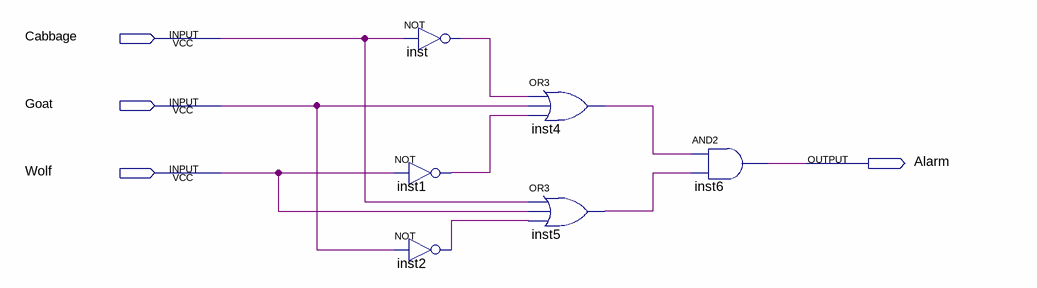
[diagram p0: schematic sheet]
// Quartus schematic lab3step0.bdf as structural Verilog: 6 symbols, 4 pins
module lab3step0 (
  input  Cabbage,
  input  Goat,
  input  Wolf,
  output Alarm
);

  wire inst1_out, inst2_out, inst4_out, inst5_out, inst_out;

  not inst (inst_out, Cabbage);
  not inst1 (inst1_out, Wolf);
  not inst2 (inst2_out, Goat);
  or inst4 (inst4_out, inst_out, Goat, inst1_out);
  or inst5 (inst5_out, Cabbage, Wolf, inst2_out);
  and inst6 (Alarm, inst4_out, inst5_out);
endmodule
